# Altium schematic sheet iso-a3.SchDoc: Title
size 420 x 297 mm; Author: Author; Organization: Organization; Revision: Revision; PageSize: A3; ProjectName: Project Name
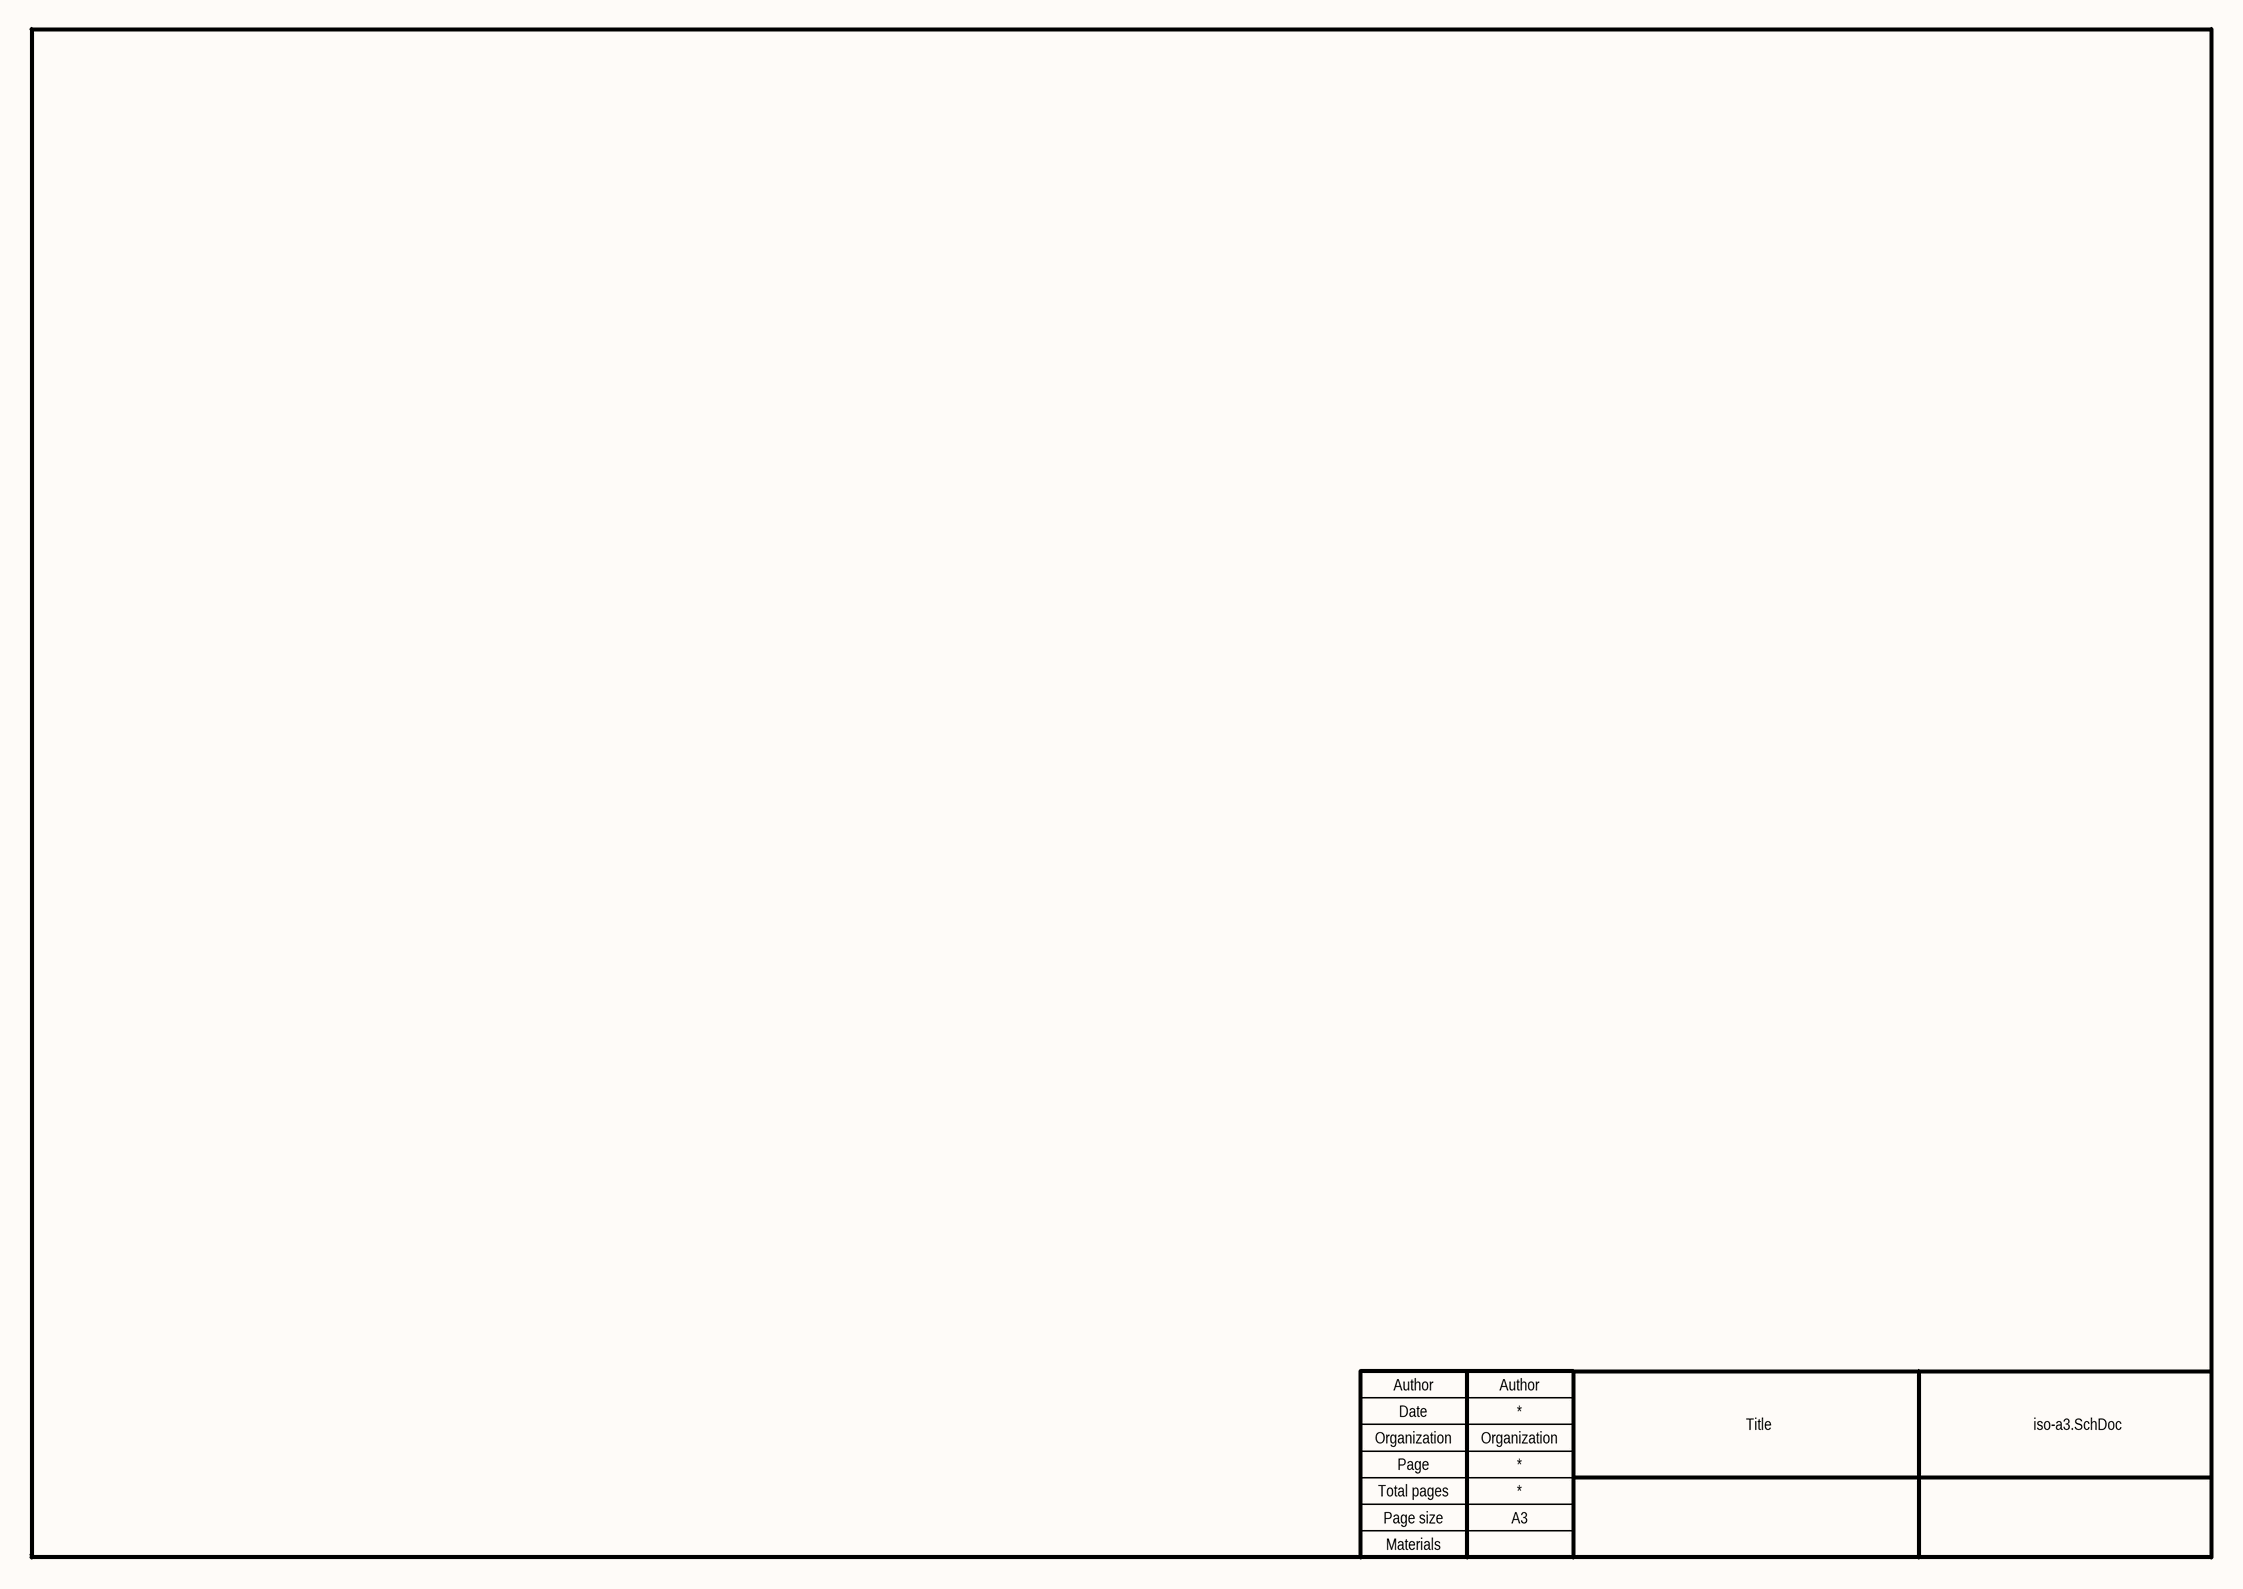
[diagram p0: iso-a3.SchDoc]

## Notes on the sheet
- Author
- Date
- Organization
- Page
- Total pages
- Materials
- Page size